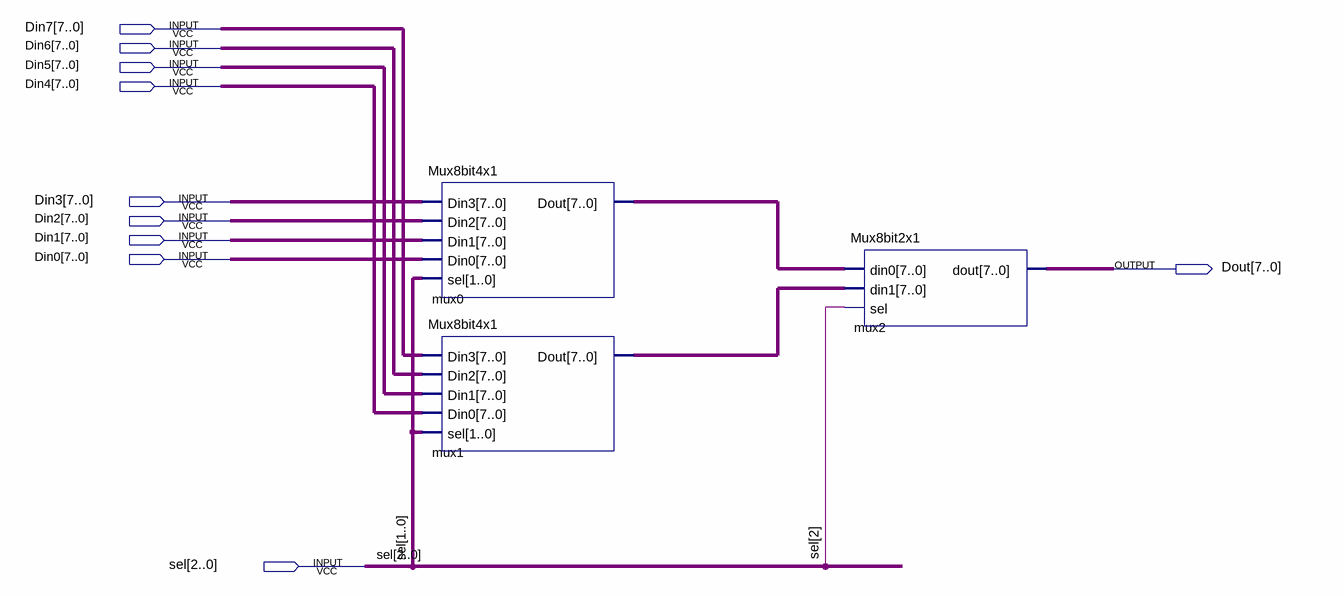
[diagram p0: schematic sheet]
// Quartus schematic Mux8bit8x1.bdf as structural Verilog: 3 symbols, 10 pins
module Mux8bit8x1 (
  input  [7:0] Din7,
  input  [7:0] Din6,
  input  [7:0] Din5,
  input  [7:0] Din4,
  input  [7:0] Din3,
  input  [7:0] Din2,
  input  [7:0] Din1,
  input  [7:0] Din0,
  input  [2:0] sel,
  output [7:0] Dout
);

  wire [7:0] mux0_dout, mux1_dout;

  Mux8bit4x1 mux0 (.Din3(Din3), .Din2(Din2), .Din1(Din1), .Din0(Din0), .sel(sel[1:0]), .Dout(mux0_dout));
  Mux8bit4x1 mux1 (.Din3(Din7), .Din2(Din6), .Din1(Din5), .Din0(Din4), .sel(sel[1:0]), .Dout(mux1_dout));
  Mux8bit2x1 mux2 (.din0(mux0_dout), .din1(mux1_dout), .sel(sel[2]), .dout(Dout));
endmodule
